# EAGLE design MPPT_ArdProMini (EAGLE 7.4.0)
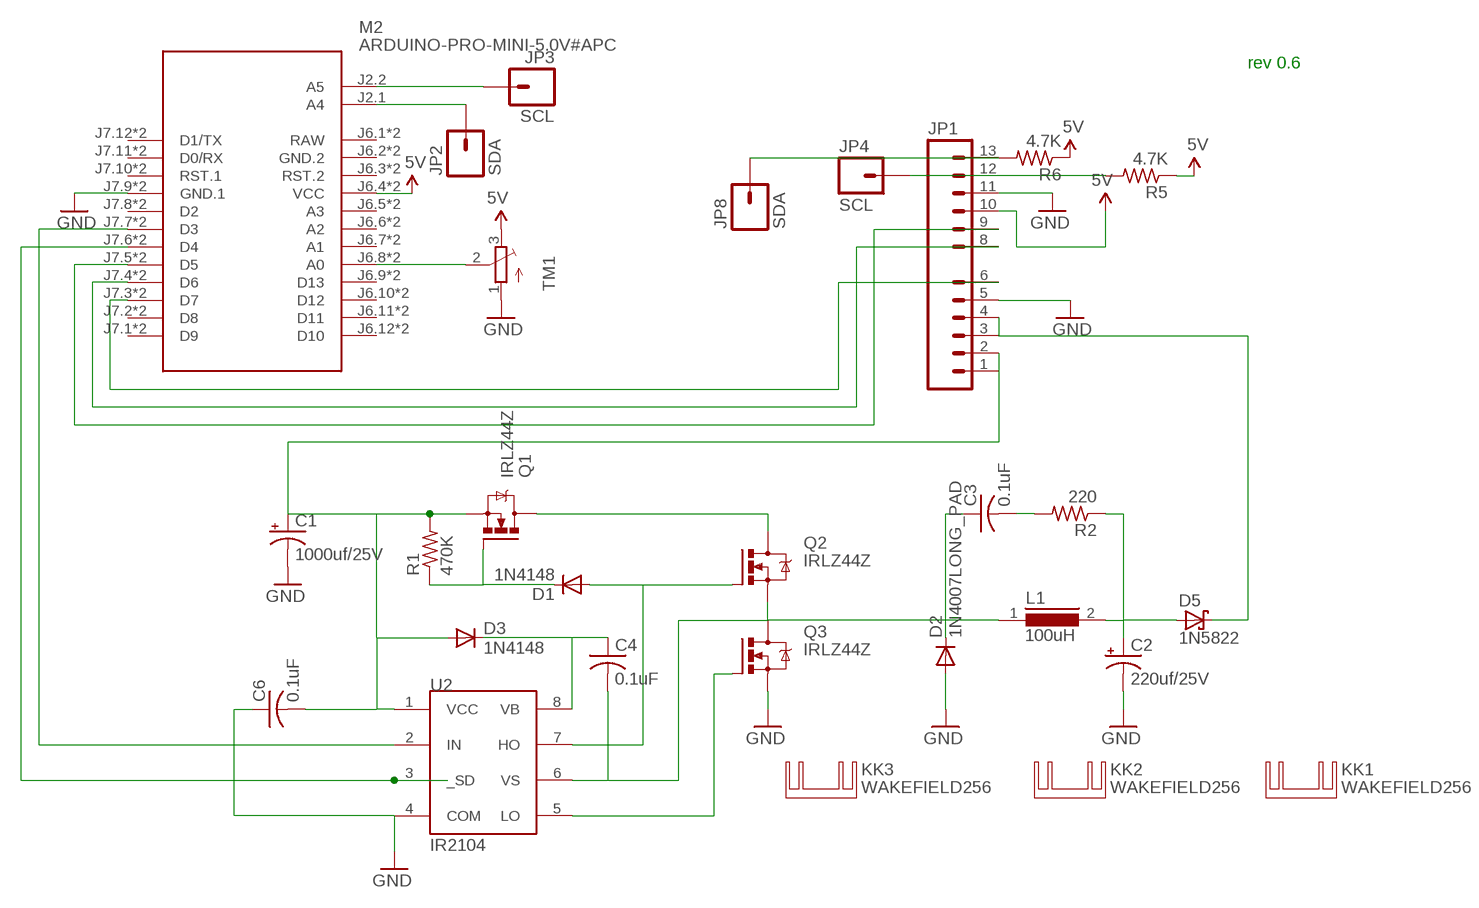
[diagram p0: schematic, sheet 1]

## Parts
C1  1000uf/25V  1000UF-25V(PTH)KIT  [CPOL-RADIAL-1000UF-25V-KIT]
C2  220uf/25V  1000UF-25V(PTH)KIT  [CPOL-RADIAL-1000UF-25V-KIT]
C3  0.1uF  C-US025-030X050  [C025-030X050]
C4  0.1uF  C-US050-030X075  [C050-030X075]
C6  0.1uF  C-US075-042X103  [C075-042X103]
D1  1N4148  1N4148DO35-10  [DO35-10]
D2  1N4007LONG_PAD  [DO35-7]
D3  1N4148  1N4148DO35-10  [DO35-10]
D5  1N5822  [DO201T15]
JP1  M06_PLUS_06MPPT  [M06_PLUS_06_MPPT]
JP2  SDA  M01  [1X01_OCT]
JP3  SCL  M01  [1X01_OCT]
JP4  SCL  M01  [1X01_OCT]
JP8  SDA  M01  [1X01_OCT]
KK1  WAKEFIELD256  [WAKEFIELD265]
KK2  WAKEFIELD256  [WAKEFIELD265]
KK3  WAKEFIELD256  [WAKEFIELD265]
L1  100uH  SFT830D  [SFT830D]
M2  ARDUINO-PRO-MINI-5.0V#APC  [ARDUINO-PRO-MINI_EXTRAPADS]
Q1  IRLZ44Z  [TO220V]
Q2  IRLZ44Z  [TO220V]
Q3  IRLZ44Z  [TO220V]
R1  470K  R-US_0204/7  [0204/7]
R2  220  R-US_0204/7  [0204/7]
R5  4.7K  R-US_0204/7  [0204/7]
R6  4.7K  R-US_0204/7  [0204/7]
TM1  TRIMPOT  [TRIM-3386U]
U2  IR2104  [DIL08]

## Nets
5V: JP1.10 M2.J6.4(VCC) M2.J6.4_LONG(VCC) R5.1 R6.1 TM1.3(E)
GND: C1.- C2.- C6.1 D2.A JP1.5 JP1.11 M2.J7.9(GND.1) M2.J7.9_LONG(GND.1) Q3.S TM1.1(A) U2.4(COM)
N$1: M2.J6.8(A0) M2.J6.8_LONG(A0) TM1.2(S)
N$2: JP1.12 JP4.1 R5.2
N$3: Q3.G U2.5(LO)
N$4: D1.C Q1.G R1.1
N$5: JP1.9 M2.J7.5(D5) M2.J7.5_LONG(D5)
N$6: D5.C JP1.3 JP1.4
N$7: Q1.D Q2.D
N$8: JP1.8 M2.J7.4(D6) M2.J7.4_LONG(D6)
N$9: JP1.6 M2.J7.3(D7) M2.J7.3_LONG(D7)
N$10: C3.2 R2.2
N$11: JP2.1 M2.J2.1(A4)
N$12: C3.1 C4.2 D2.C L1.1 Q2.S Q3.D U2.6(VS)
N$13: C2.+ D5.A L1.2 R2.1
N$14: JP3.1 M2.J2.2(A5)
N$17: M2.J7.7(D3) M2.J7.7_LONG(D3) U2.2(IN)
N$29: M2.J7.6(D4) M2.J7.6_LONG(D4) U2.3(_SD)
N$39: D1.A Q2.G U2.7(HO)
SDA: JP1.13 JP8.1 R6.2
VB: C4.1 D3.C U2.8(VB)
VCC: C1.+ C6.2 D3.A JP1.1 JP1.2 Q1.S R1.2 U2.1(VCC)
Unconnected: M2.J6.3(RST.2) M2.J6.3_LONG(RST.2) M2.J6.5(A3) M2.J6.5_LONG(A3) M2.J6.6(A2) M2.J6.6_LONG(A2) M2.J6.7(A1) M2.J6.7_LONG(A1) M2.J6.9(D13) M2.J6.9_LONG(D13) M2.J6.10(D12) M2.J6.10_LONG(D12) M2.J6.11(D11) M2.J6.11_LONG(D11) M2.J6.12(D10) M2.J6.12_LONG(D10) M2.J7.1(D9) M2.J7.1_LONG(D9) M2.J7.2(D8) M2.J7.2_LONG(D8) M2.J7.8(D2) M2.J7.8_LONG(D2) M2.J7.10(RST.1) M2.J7.10_LONG(RST.1) M2.J7.11(D0/RX) M2.J7.11_LONG(D0/RX) M2.J7.12(D1/TX) M2.J7.12_LONG(D1/TX)

## Notes on the sheet
- rev 0.6

## Power pins joined to a net without a drawn wire
GND.2: M2.J6.2(GND.2) M2.J6.2_LONG(GND.2)
RAW: M2.J6.1(RAW) M2.J6.1_LONG(RAW)

## Library data of the parts
C1 = SparkFun-Capacitors:1000UF-25V(PTH): CAP-08070; PROD_ID: CAP-09538
C2 = SparkFun-Capacitors:1000UF-25V(PTH): CAP-08070; PROD_ID: CAP-09538; VALUE: 1000uf/25V
C3 C4 C6 = resistor:C-US: CAPACITOR, American symbol
D1 D3 = tmb_diode:1N4148: DIODE high speed (Philips)
D2 = tmb_diode:1N4007: DIODE general purpose rectifier, 1 A
D5 = tmb_diode:1N5822: DIODE
JP1 = tmb_connectors:M06_PLUS_06: 13-pin single row .1" header
JP2-JP4 JP8 = tmb_connectors:M01: Header 1 Standard 1-pin 0.1" header. Use with straight break away headers (SKU : PRT-00116), right angle break away headers (PRT-00553), swiss pins (PRT-00743), machine pins (PRT-00117), and female headers (PRT-00115). SMTSO-256-ET is a "flush mount" nut for a 4-40 screw. The older package used to be too tight, and did not allow it to sit properly thru the drill hit. The latest (0.165DIA) fits nice and snug.
KK1-KK3 = tmb_heatsink:WAKEFIELD256: heatsink from Zen spinlde controller
L1 = inductors:SFT830D: INDUCTOR
M2 = tmb_boards:ARDUINO-PRO-MINI-*#APC: Arduino Pro Mini with angle programming connector
Q1-Q3 = tmb_mosfet:IRLZ44Z: N-Channel HEXFET® Power MOSFET Logic Level AUTOMOTIVE MOSFET Source: http://www.irf.com/product-info/datasheets/data/irlz44zpbf.pdf
R1 R2 R5 R6 = tmb_resistor:R-US_: RESISTOR, American symbol
TM1 = tmb_trimpot:TRIMPOT: SMT trimmer potentiometer part number TC33X
U2 = tmb_mosfet:IR2104: Half bridge driver

## Board
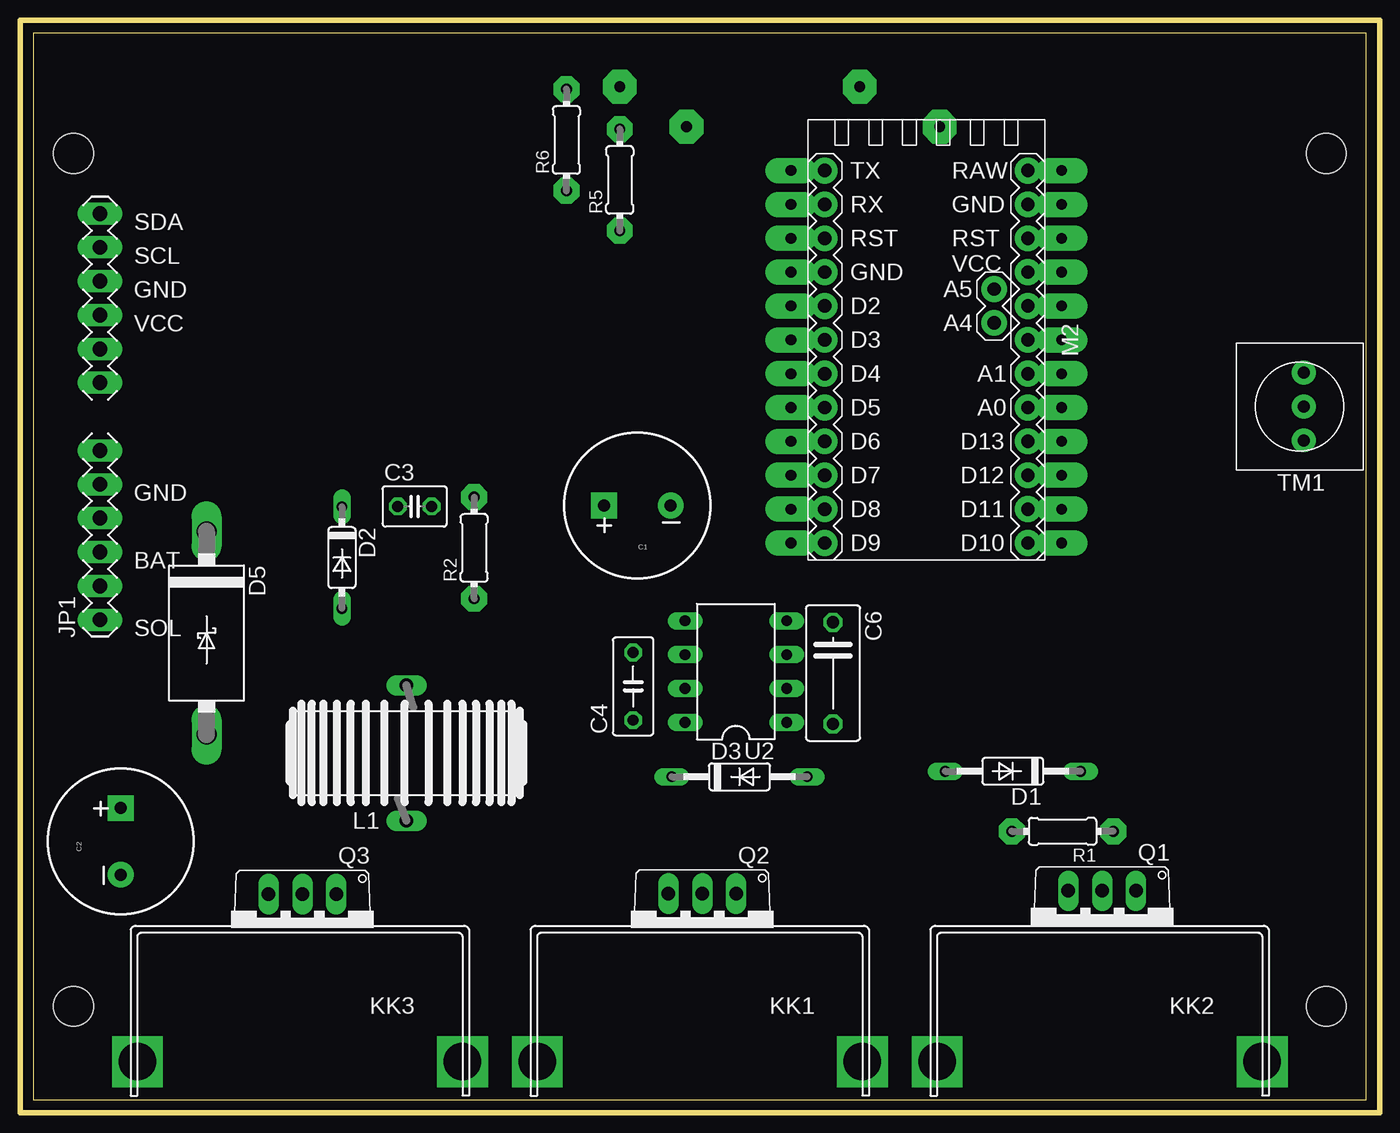
[diagram p1: board, top side]
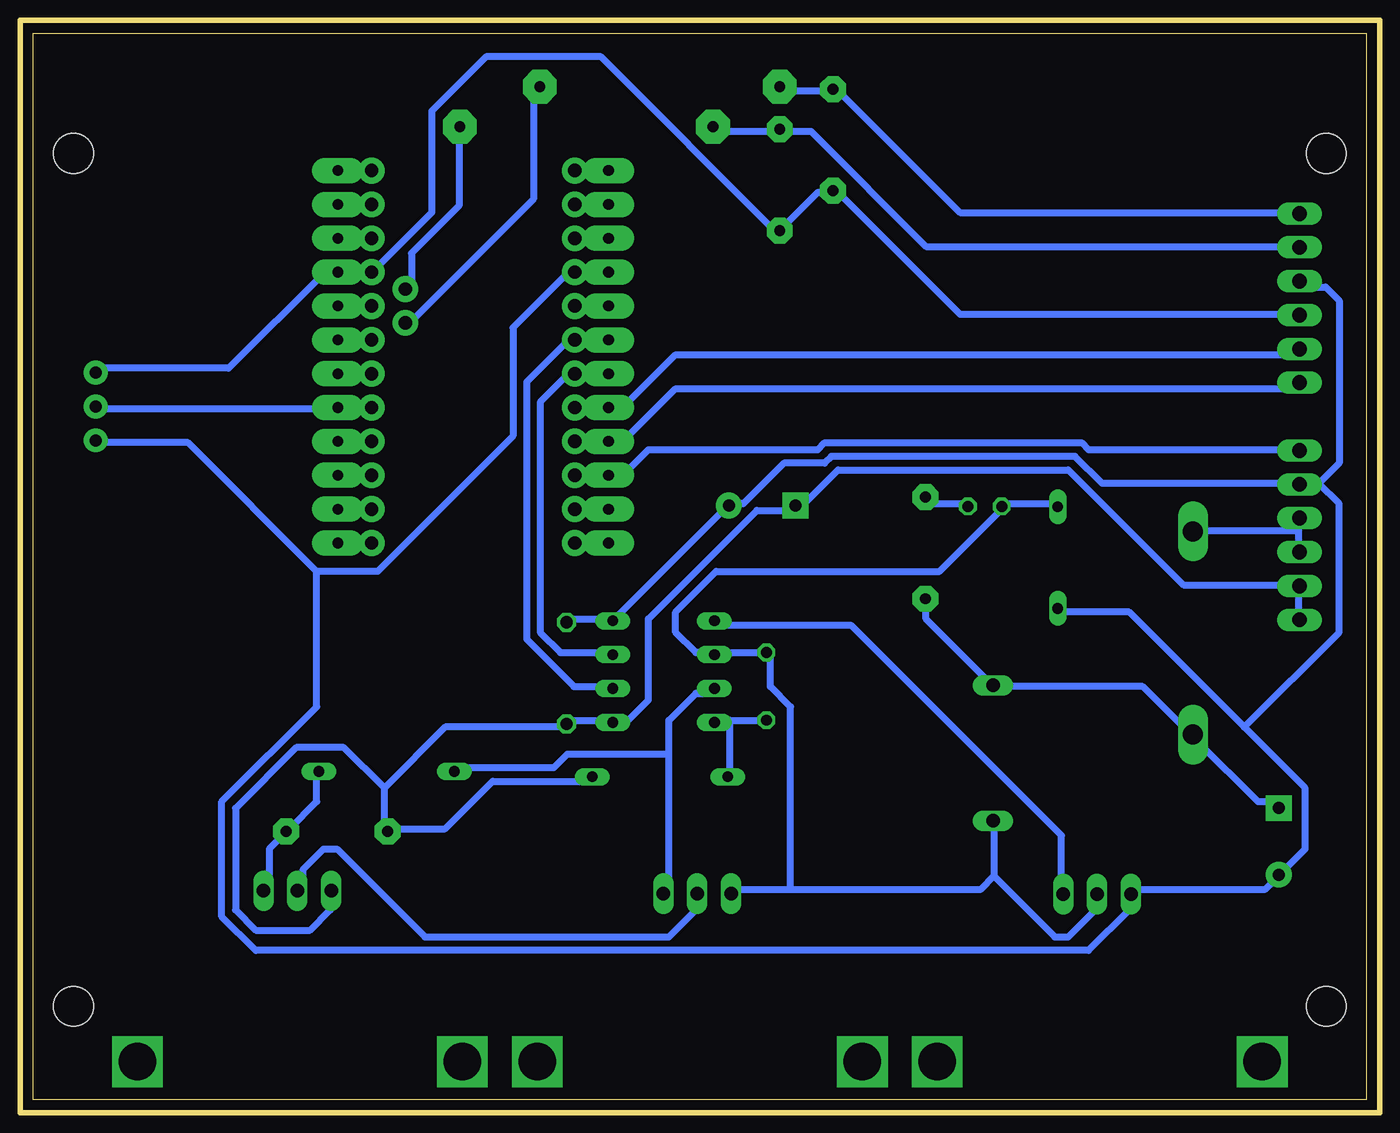
[diagram p2: board, bottom side, seen from below]

Size 100 x 80 mm. Coordinates in mm from the lower left corner, seen from the top.
Outline: 0,0 100,0 100,80 0,80 0,0
Copper layers (1*16): Top 0.035mm / dielectric 1.5mm / Bottom 0.035mm
Design rules "PCBMilling": minimum track width 20mil, minimum drill 24mil, track to track 20mil, track to pad 20mil, pad to pad 8mil, via to via 8mil, smd to smd 8mil, copper to edge 40mil, drill to drill 8mil, minimum pad ring 10mil, minimum via ring 8mil, stop-mask expansion 4mil, vias tented up to drill 0mil, thermal gap 10mil
Holes 3 mm at 3,7 97,7 97,71 3,71
Milling: 4 lines

### Footprints (pad centres in the part's own frame; a part is rotated, then mirrored left to right if it is on the bottom)
CPOL-RADIAL-1000UF-25V-KIT = drill 0.9 pad 1.93 square: + 2.5,0 | drill 0.9 pad 1.93: - -2.5,0
C025-030X050 = drill 0.813 octagon: 1 -1.27,0; 2 1.27,0
C050-030X075 = drill 0.813 octagon: 1 -2.54,0; 2 2.54,0
C075-042X103 = drill 0.914 octagon: 1 -3.81,0; 2 3.81,0
DO35-10 = drill 0.813 long: A 5.08,0; C -5.08,0
DO35-7 = drill 0.813 long: A 3.81,0; C -3.81,0
DO201T15 = drill 1.499 long: A 7.62,0; C -7.62,0
M06_PLUS_06_MPPT = drill 1.118 long: 1 0,0; 2 2.54,0; 3 5.08,0; 4 7.62,0; 5 10.16,0; 6 12.7,0; 8 17.78,0; 9 20.32,0; 10 22.86,0; 11 25.4,0; 12 27.94,0; 13 30.48,0
1X01_OCT = drill 0.813 pad 2.54 octagon: 1 0,0
WAKEFIELD265 = drill 2.8 square: P$1 12.192,10.16; P$2 -12.192,10.16
SFT830D = drill 1.016 long: 1 -5.08,0; 2 5.08,0
ARDUINO-PRO-MINI_EXTRAPADS = drill 1 pad 1.93: J2.1 -1.27,5.08; J2.2 -3.81,5.08; J6.1 -12.7,7.62; J6.2 -10.16,7.62; J6.3 -7.62,7.62; J6.4 -5.08,7.62; J6.5 -2.54,7.62; J6.6 0,7.62; J6.7 2.54,7.62; J6.8 5.08,7.62; J6.9 7.62,7.62; J6.10 10.16,7.62; J6.11 12.7,7.62; J6.12 15.24,7.62; J7.1 15.24,-7.62; J7.2 12.7,-7.62; J7.3 10.16,-7.62; J7.4 7.62,-7.62; J7.5 5.08,-7.62; J7.6 2.54,-7.62; J7.7 0,-7.62; J7.8 -2.54,-7.62; J7.9 -5.08,-7.62; J7.10 -7.62,-7.62; J7.11 -10.16,-7.62; J7.12 -12.7,-7.62 | drill 0.8 pad 1.93 long: J6.1_LONG -12.7,10.16; J6.2_LONG -10.16,10.16; J6.3_LONG -7.62,10.16; J6.4_LONG -5.08,10.16; J6.5_LONG -2.54,10.16; J6.6_LONG 0,10.16; J6.7_LONG 2.54,10.16; J6.8_LONG 5.08,10.16; J6.9_LONG 7.62,10.16; J6.10_LONG 10.16,10.16; J6.11_LONG 12.7,10.16; J6.12_LONG 15.24,10.16; J7.1_LONG 15.24,-10.16; J7.2_LONG 12.7,-10.16; J7.3_LONG 10.16,-10.16; J7.4_LONG 7.62,-10.16; J7.5_LONG 5.08,-10.16; J7.6_LONG 2.54,-10.16; J7.7_LONG 0,-10.16; J7.8_LONG -2.54,-10.16; J7.9_LONG -5.08,-10.16; J7.10_LONG -7.62,-10.16; J7.11_LONG -10.16,-10.16; J7.12_LONG -12.7,-10.16
TO220V = drill 1.016 long: D 0,-2.54; G -2.54,-2.54; S 2.54,-2.54
0204/7 = drill 0.813 pad 1.93 octagon: 1 -3.81,0; 2 3.81,0
TRIM-3386U = drill 0.9 pad 1.778: 1 -2.54,-0.318; 2 0,-0.318; 3 2.54,-0.318
DIL08 = drill 0.813 long: 1 -3.81,-3.81; 2 -1.27,-3.81; 3 1.27,-3.81; 4 3.81,-3.81; 5 3.81,3.81; 6 1.27,3.81; 7 -1.27,3.81; 8 -3.81,3.81

### Placement (x,y rotation side)
C1  45.32,44.57 180 top
C2  6.56,19.37 90 top
C3  28.61,44.5 0 top
C4  45,31 90 top
C6  60,32 270 top
D1  73.49,24.63 180 top
D2  23.15,40.66 270 top
D3  52.98,24.22 0 top
D5  13,35 270 top
JP1  5,36 90 top
JP2  62,76 0 top
JP3  68,73 0 top
JP4  49,73 0 top
JP8  44,76 0 top
KK1  50,13 180 top
KK2  80,13 180 top
KK3  20,13 180 top
L1  28,26 90 top
M2  67,57 270 top
Q1  80.19,13.12 180 top
Q2  50.19,12.9 180 top
Q3  20.19,12.88 180 top
R1  77.22,20.12 180 top
R2  33.07,41.39 90 top
R5  44,69 90 top
R6  40,72 90 top
TM1  95,52 90 top
U2  52.71,32.11 90 top

### Tracks (layer width: path | path; a pad name or v marks a point on that pad's centre or on a via)
5V
  Bottom 0.508: TM1.3 95,54.86 85.34,54.86 78.23,61.98 77.22,61.98 M2.J6.4_LONG 76.71,61.98 74.68,61.98 M2.J6.4 74.17,62.48 70.1,66.55 70.1,74.17 66.04,78.23 57.4,78.23 44.2,65.02 R5.1 43.69,65.53 41.15,68.07 40.13,68.07 R6.1 39.62,68.07 30.48,58.93 5.08,58.93 JP1.10
GND
  Bottom 0.508: 78.74,39.62 88.39,49.28 95,49.28 TM1.1 | 78.74,39.62 74.17,39.62 64.01,49.78 64.01,57.91 59.44,62.48 M2.J7.9 58.93,61.98 56.9,61.98 M2.J7.9_LONG | C6.1 59.94,36.07 56.9,36.07 U2.4 56.39,36.07 48.26,44.2 C1.- 47.75,44.7 46.74,44.7 43.69,47.75 40.64,47.75 40.13,48.26 21.84,48.26 19.81,46.23 5.08,46.23 JP1.5 | 3.56,46.23 4.57,46.23 JP1.5 | 3.56,46.23 2.03,47.75 2.03,59.94 3.05,60.96 4.57,60.96 JP1.11 | 9.14,27.94 4.57,23.37 4.57,18.8 6.1,17.27 C2.- 6.6,16.76 7.62,15.75 17.27,15.75 Q3.S 17.78,15.24 17.78,14.22 20.83,11.18 83.31,11.18 85.85,13.72 85.85,22.35 78.74,29.46 78.74,39.62 | 9.14,27.94 17.78,36.58 22.86,36.58 D2.A | 3.56,46.23 2.03,44.7 2.03,35.05 9.14,27.94 | 3.56,46.23 JP1.5
GND.2
  Bottom 0.508: M2.J6.2_LONG 76.71,67.06 74.68,67.06 M2.J6.2
N$1
  Bottom 0.508: TM1.2 95,51.82 77.22,51.82 M2.J6.8_LONG 76.71,51.82 74.68,51.82 M2.J6.8
N$2
  Bottom 0.508: JP4.1 48.77,72.64 44.2,72.64 R5.2 43.69,72.64 41.66,72.64 33.02,64.01 5.08,64.01 JP1.12
N$3
  Bottom 0.508: U2.5 48.77,35.56 38.61,35.56 22.86,19.81 22.86,15.75 Q3.G
N$4
  Bottom 0.508: D1.C 78.74,24.38 78.74,22.35 80.77,20.32 R1.1 81.28,19.81 82.3,18.8 82.3,15.75 Q1.G
N$5
  Bottom 0.508: M2.J7.5 58.93,51.82 56.9,51.82 M2.J7.5_LONG 56.39,52.32 55.37,52.32 51.82,55.88 5.08,55.88 JP1.9
N$6
  Bottom 0.508: 5.08,42.67 5.08,43.18 JP1.4 5.08,42.67 | 5.08,42.67 5.08,41.15 JP1.3 | 5.08,42.67 12.7,42.67 D5.C
N$7
  Bottom 0.508: Q2.D 50.29,15.24 50.29,14.22 52.32,12.19 70.61,12.19 77.22,18.8 78.23,18.8 79.76,17.27 79.76,15.75 Q1.D
N$8
  Bottom 0.508: M2.J7.4 58.93,49.28 56.9,49.28 M2.J7.4_LONG 56.39,49.78 55.37,49.78 51.82,53.34 5.08,53.34 JP1.8
N$9
  Bottom 0.508: M2.J7.3 58.93,46.74 56.9,46.74 M2.J7.3_LONG 56.39,47.24 55.37,47.24 53.85,48.77 41.15,48.77 40.64,49.28 21.34,49.28 20.83,48.77 5.08,48.77 JP1.6
N$10
  Bottom 0.508: C3.2 29.97,44.7 33.02,44.7 R2.2
N$11
  Bottom 0.508: M2.J2.1 71.63,58.42 62.48,67.56 62.48,75.69 JP2.1
N$12
  Bottom 0.508: D2.C 23.37,44.7 26.92,44.7 C3.1 27.43,44.2 32,39.62 48.77,39.62 51.82,36.58 51.82,35.05 50.29,33.53 49.28,33.53 U2.6 48.77,33.53 45.21,33.53 C4.2 44.7,33.53 44.7,30.99 43.18,29.46 43.18,15.75 | 27.94,16.76 23.37,12.19 22.35,12.19 20.32,14.22 20.32,15.24 Q3.D | 27.94,16.76 27.94,20.83 L1.1 | 43.18,15.75 28.96,15.75 27.94,16.76 | 43.18,15.75 47.24,15.75 Q2.S
N$13
  Bottom 0.508: R2.1 33.02,37.08 33.02,36.07 28.45,31.5 L1.2 27.94,30.99 16.76,30.99 13.21,27.43 D5.A 12.7,26.92 8.13,22.35 6.6,22.35 C2.+
N$14
  Bottom 0.508: M2.J2.2 71.63,60.96 71.63,63.5 68.07,67.06 68.07,72.64 JP3.1
N$17
  Bottom 0.508: U2.2 56.9,30.99 59.44,30.99 62.99,34.54 62.99,53.85 59.44,57.4 M2.J7.7 58.93,56.9 56.9,56.9 M2.J7.7_LONG
N$29
  Bottom 0.508: U2.3 56.9,33.53 60.45,33.53 61.98,35.05 61.98,52.32 59.44,54.86 M2.J7.6 58.93,54.36 56.9,54.36 M2.J7.6_LONG
N$39
  Bottom 0.508: 52.32,25.91 52.32,15.75 Q2.G | 52.32,25.91 52.32,28.45 50.29,30.48 49.28,30.48 U2.7 | 52.32,25.91 59.94,25.91 60.96,24.89 68.07,24.89 D1.A
RAW
  Bottom 0.508: M2.J6.1_LONG 76.71,69.6 74.68,69.6 M2.J6.1
SDA
  Bottom 0.508: JP8.1 43.69,75.69 40.13,75.69 R6.2 39.62,75.69 30.48,66.55 5.08,66.55 JP1.13
VB
  Bottom 0.508: 47.75,28.45 48.77,28.45 U2.8 47.75,28.45 | 47.75,28.45 45.21,28.45 C4.1 | 47.75,28.45 47.75,24.38 D3.C
VCC
  Bottom 0.508: D3.A 58.42,23.88 65.53,23.88 69.09,20.32 73.15,20.32 R1.2 73.66,20.32 73.66,23.37 | 73.66,23.37 76.71,26.42 80.26,26.42 84.84,21.84 84.84,14.22 83.31,12.7 79.25,12.7 77.72,14.22 77.72,15.24 Q1.S | JP1.1 5.08,36.07 5.08,38.1 JP1.2 5.08,38.61 13.72,38.61 22.35,47.24 39.62,47.24 42.67,44.2 C1.+ 43.18,44.2 45.72,44.2 53.85,36.07 53.85,29.97 55.37,28.45 56.39,28.45 U2.1 56.9,28.45 59.94,28.45 C6.2 60.45,27.94 69.09,27.94 73.66,23.37